# EAGLE design Codeshelf-0005.v02 (EAGLE 6.5.0)

## Sheet 1 of 2
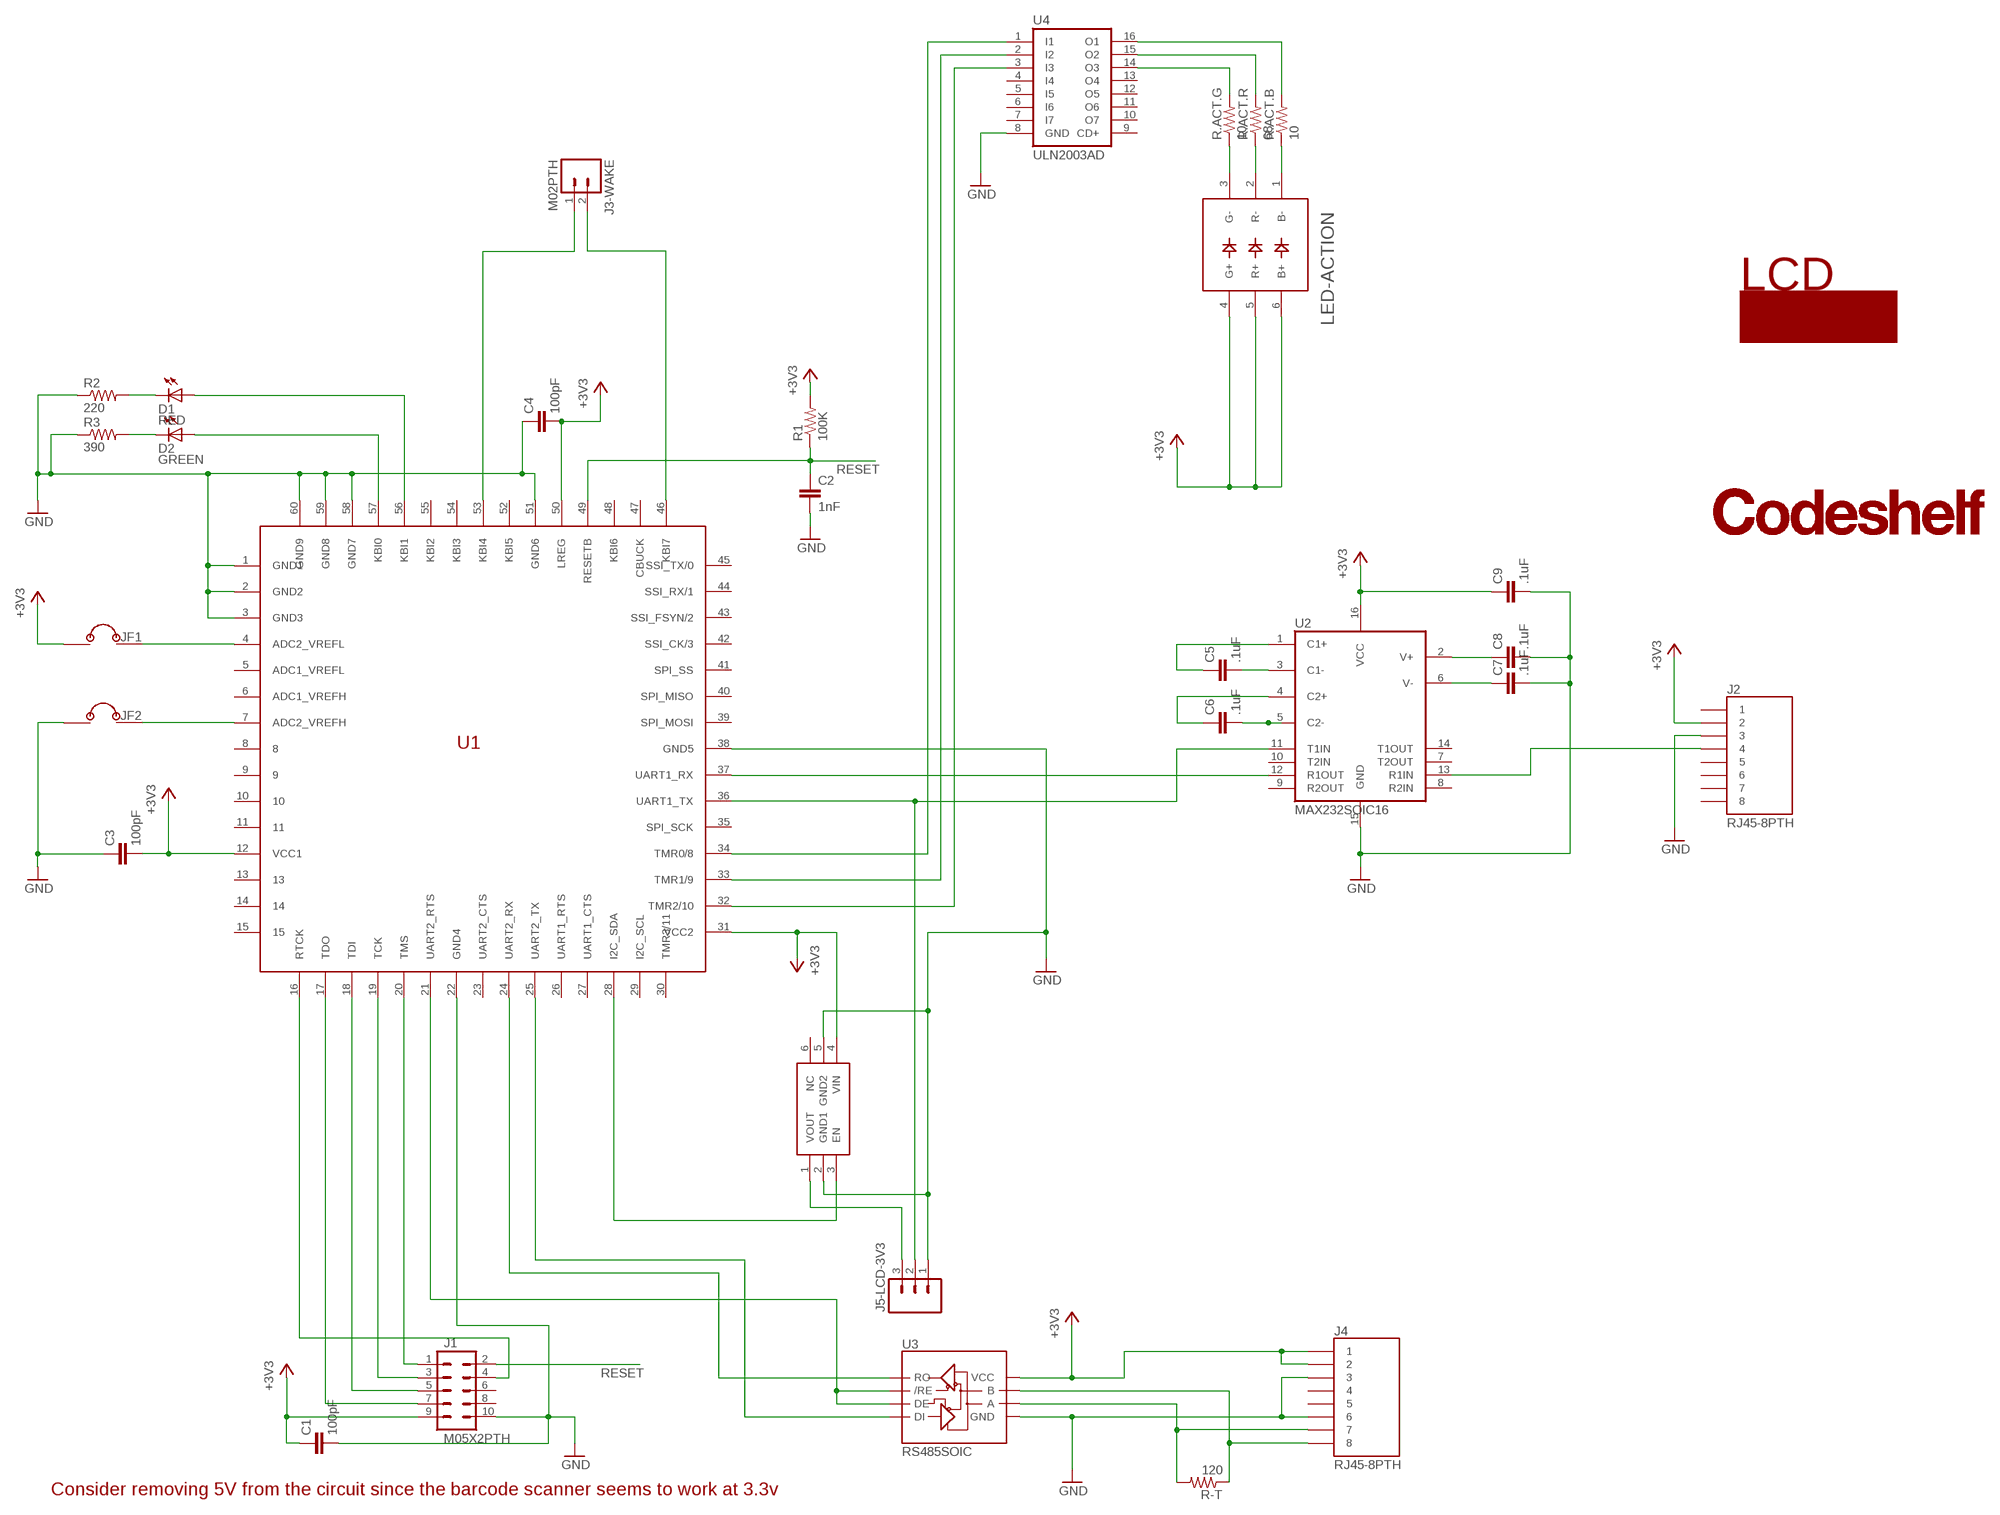
[diagram p0: schematic, sheet 1]

### Parts
C1  100pF  RF-C0603  [C0603]
C2  1nF  RF-C0603  [C0603]
C3  100pF  RF-C0603  [C0603]
C4  100pF  RF-C0603  [C0603]
C5  .1uF  RF-C0402  [C0402]
C6  .1uF  RF-C0402  [C0402]
C7  .1uF  RF-C0402  [C0402]
C8  .1uF  RF-C0402  [C0402]
C9  .1uF  RF-C0402  [C0402]
D1  RED  LEDCHIP-LED0805  [CHIP-LED0805]
D2  GREEN  LEDCHIP-LED0805  [CHIP-LED0805]
J1  M05X2PTH  [AVR_ICSP]
J2  RJ45-8PTH  [RJ45-8]
J3-WAKE  M02PTH  [1X02]
J4  RJ45-8PTH  [RJ45-8]
J5-LCD-3V3  M03PTH  [1X03]
JF1  JUMPER-2X-SMT-VIA  [JUMPER-VIA-2X]
JF2  JUMPER-2X-SMT-VIA  [JUMPER-VIA-2X]
LCD  LCD-SPARKFUN  LCD-SPARKFUN20X4  [LCD-20X4-SPARKFUN]
LED-ACTION  LED5060A  [PLCC-6]
LOGO  CODESHELF-LOGO  [CODESHELF-LOGO]
R1  100K  RF-R0402  [RF-R0402]
R2  220  RF-R0402  [RF-R0402]
R3  390  RF-R0402  [RF-R0402]
R-T  120  RF-R0402  [RF-R0402]
R.ACT.B  10  RF-R0402  [RF-R0402]
R.ACT.G  10  RF-R0402  [RF-R0402]
R.ACT.R  68  RF-R0402  [RF-R0402]
U1  ZSFM201-1A  [ZSFM201-1]
U2  MAX232SOIC16  [SO016]
U3  RS485SOIC  [SO08]
U4  ULN2003AD  [SO16]
U6  MIC94061C6  [SC70-6L]

### Nets
+3V3: C1.1 C3.2 C4.2 C9.1 J1.9 J2.2 J4.1 J4.2 JF1.1 LED-ACTION.4(G+) LED-ACTION.5(R+) LED-ACTION.6(B+) R1.2 U1.12(VCC1) U1.31(VCC2) U1.50(LREG) U2.16(VCC) U3.8(VCC) U6.4(VIN) ; also sheet 2
C1: C5.1 U2.1(C1+)
C2: C6.1 U2.4(C2+)
GND [GND]: C1.2 C2.2 C3.1 C4.1 C7.2 C8.2 C9.2 J1.10 J2.3 J4.3 J4.6 J5-LCD-3V3.1 JF2.1 R2.1 R3.1 U1.1(GND1) U1.2(GND2) U1.3(GND3) U1.22(GND4) U1.38(GND5) U1.51(GND6) U1.58(GND7) U1.59(GND8) U1.60(GND9) U2.15(GND) U3.5(GND) U4.8(GND) U6.2(GND1) U6.5(GND2) ; also sheet 2
N$1: D2.A U1.57(KBI0)
N$2: D1.A U1.56(KBI1)
N$3: D2.C R3.2
N$4: D1.C R2.2
N$6 [GND]: JF2.2 U1.7(ADC2_VREFH)
N$7 [+3V3]: JF1.2 U1.4(ADC2_VREFL)
N$8: C5.2 U2.3(C1-)
N$9: U1.28(I2C_SDA) U6.3(EN)
N$10 [+3V3]: J5-LCD-3V3.3 U6.1(VOUT)
N$11: C6.2 U2.5(C2-)
N$12: C7.1 U2.6(V-)
N$14: J3-WAKE.2 U1.46(KBI7)
N$15: C8.1 U2.2(V+)
N$16: J3-WAKE.1 U1.53(KBI4)
N$17: U1.25(UART2_TX) U3.4(DI)
N$18: U1.24(UART2_RX) U3.1(RO)
N$19: U1.21(UART2_RTS) U3.2(/RE) U3.3(DE)
N$20 [RS485]: J4.8 R-T.1 U3.7(B)
N$21 [RS485]: J4.7 R-T.2 U3.6(A)
N$28: R.ACT.R.2 U4.15(O2)
N$30: R.ACT.G.2 U4.14(O3)
N$33: LED-ACTION.1(B-) R.ACT.B.1
N$34: LED-ACTION.2(R-) R.ACT.R.1
N$35: LED-ACTION.3(G-) R.ACT.G.1
N$36: U1.34(TMR0/8) U4.1(I1)
N$37: U1.33(TMR1/9) U4.2(I2)
N$38: R.ACT.B.2 U4.16(O1)
N$39: U1.32(TMR2/10) U4.3(I3)
R1IN: J2.4 U2.13(R1IN)
R1OUT: U1.37(UART1_RX) U2.12(R1OUT)
RESET: C2.1 J1.2 R1.1 U1.49(RESETB)
RTCK: J1.4 U1.16(RTCK)
T1IN: J5-LCD-3V3.2 U1.36(UART1_TX) U2.11(T1IN)
TCK: J1.3 U1.19(TCK)
TDI: J1.5 U1.18(TDI)
TDO: J1.7 U1.17(TDO)
TMS: J1.1 U1.20(TMS)
Unconnected: J1.6 J1.8 J2.1 J2.5 J2.6 J2.7 J2.8 J4.4 J4.5 U1.5(ADC1_VREFL) U1.6(ADC1_VREFH) U1.8 U1.9 U1.10 U1.11 U1.13 U1.14 U1.15 U1.23(UART2_CTS) U1.26(UART1_RTS) U1.27(UART1_CTS) U1.29(I2C_SCL) U1.30(TMR3/11) U1.35(SPI_SCK) U1.39(SPI_MOSI) U1.40(SPI_MISO) U1.41(SPI_SS) U1.42(SSI_CK/3) U1.43(SSI_FSYN/2) U1.44(SSI_RX/1) U1.45(SSI_TX/0) U1.47(CBUCK) U1.48(KBI6) U1.52(KBI5) U1.54(KBI3) U1.55(KBI2) U2.7(T2OUT) U2.8(R2IN) U2.9(R2OUT) U2.10(T2IN) U2.14(T1OUT) U4.4(I4) U4.5(I5) U4.6(I6) U4.7(I7) U4.9(CD+) U4.10(O7) U4.11(O6) U4.12(O5) U4.13(O4) U6.6(NC)

### Notes on the sheet
- Consider removing 5V from the circuit since the barcode scanner seems to work at 3.3v

## Sheet 2 of 2
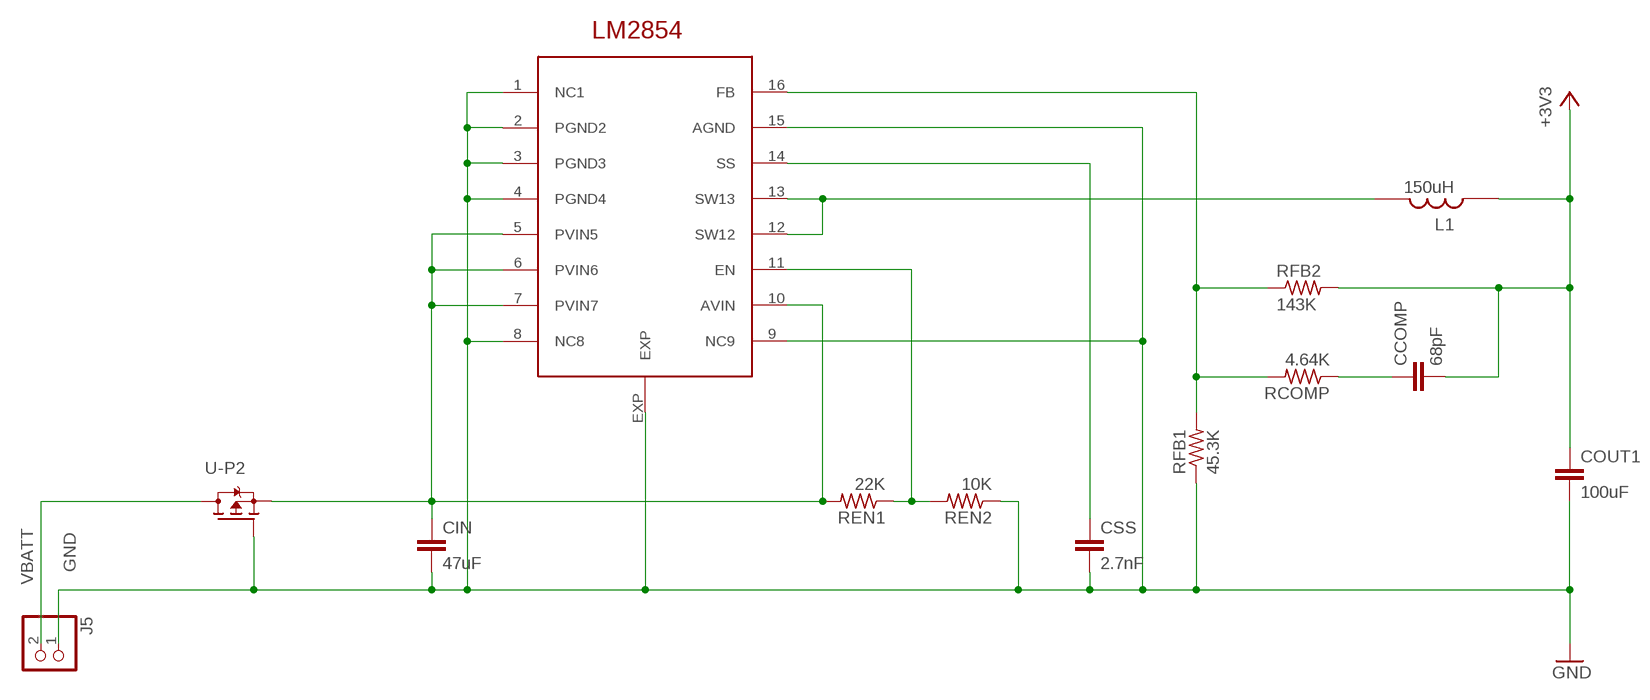
[diagram p1: schematic, sheet 2]

### Parts
CCOMP  68pF  RF-C0805  [C0805]
CIN  47uF  RF-C1210  [C1210K]
COUT1  100uF  RF-C1210  [C1210K]
CSS  2.7nF  RF-C0805  [C0805]
J5  PINHD-1X2/90  [1X02/90]
L1  150uH  INDUCTOR-SMD-UNUSUAL-SLF10165  [SLF10165]
RCOMP  4.64K  RF-R0402  [RF-R0402]
REN1  22K  RF-R0402  [RF-R0402]
REN2  10K  RF-R0402  [RF-R0402]
RFB1  45.3K  RF-R0402  [RF-R0402]
RFB2  143K  RF-R0402  [RF-R0402]
U-P1  LM2854MH  [HTSSOP16PWP]
U-P2  PCHANNEL-MOSFET-DPAK  [DPAK]

### Nets
+3V3: CCOMP.2 COUT1.1 L1.2 RFB2.2 ; also sheet 1
GND [GND]: CIN.2 COUT1.2 CSS.2 J5.1 REN2.1 RFB1.1 U-P1.1(NC1) U-P1.2(PGND2) U-P1.3(PGND3) U-P1.4(PGND4) U-P1.8(NC8) U-P1.9(NC9) U-P1.15(AGND) U-P1.EXP U-P2.1(G) ; also sheet 1
N$22: CSS.1 U-P1.14(SS)
N$23: L1.1 U-P1.12(SW12) U-P1.13(SW13)
N$24: RCOMP.2 RFB1.2 RFB2.1 U-P1.16(FB)
N$25: CCOMP.1 RCOMP.1
N$26: REN1.1 REN2.2 U-P1.11(EN)
V-PROT: CIN.1 REN1.2 U-P1.5(PVIN5) U-P1.6(PVIN6) U-P1.7(PVIN7) U-P1.10(AVIN) U-P2.3(S)
VBATT: J5.2 U-P2.4(D)

## Library data of the parts
C1 C3 C4 = GW-devices:RF-C: RF capacitor pads for FSL reference design; MFGN: Kemet; MFGP: C0603C101K5RACTU
C2 = GW-devices:RF-C: RF capacitor pads for FSL reference design; MFGN: Kemet; MFGP: C0603C102K4RACTU
C5-C9 = GW-devices:RF-C: RF capacitor pads for FSL reference design; MFGN: Murata; MFGP: GRM155R61C104KA88D; PRICE: 0.03
CCOMP = GW-devices:RF-C: RF capacitor pads for FSL reference design; MFGN: Yageo; MFGP: CC0805JRNPO9BN680; PRICE: 0.05
CIN = GW-devices:RF-C: RF capacitor pads for FSL reference design; MFGN: TDK; MFGP: C3225X5R1A476M250AC; PRICE: 1.03
COUT1 = GW-devices:RF-C: RF capacitor pads for FSL reference design; MFGN: TDK; MFGP: C3225X5R0J107M250AC; PRICE: 1.15
CSS = GW-devices:RF-C: RF capacitor pads for FSL reference design; MFGN: Yageo; MFGP: CC0805KRX7R9BB272; PRICE: 0.03
D1 = led:LED: LED OSRAM: - CHIPLED LG R971, LG N971, LY N971, LG Q971, LY Q971, LO R971, LY R971 LH N974, LH R974 LS Q976, LO Q976, LY Q976 LO Q996 - Hyper CHIPLED LW Q18S LB Q993, LB Q99A, LB R99A - SideLED LS A670, LO A670, LY A670, LG A670, LP A670 LB A673, LV A673, LT A673, LW A673 LH A674 LY A675 LS A676, LA A676, LO A676, LY A676, LW A676 LS A679, LY A679, LG A679 - Hyper Micro SIDELED® LS Y876, LA Y876, LO Y876, LY Y876 LT Y87S - SmartLED LW L88C, LW L88S LB L89C, LB L89S, LG L890 LS L89K, LO L89K, LY L89K LS L896, LA L896, LO L896, LY L896 - TOPLED LS T670, LO T670, LY T670, LG T670, LP T670 LSG T670, LSP T670, LSY T670, LOP T670, LYG T670 LG T671, LOG T671, LSG T671 LB T673, LV T673, LT T673, LW T673 LH T674 LS T676, LA T676, LO T676, LY T676, LB T676, LH T676, LSB T676, LW T676 LB T67C, LV T67C, LT T67C, LS T67K, LO T67K, LY T67K, LW E67C LS E67B, LA E67B, LO E67B, LY E67B, LB E67C, LV E67C, LT E67C LW T67C LS T679, LY T679, LG T679 LS T770, LO T770, LY T770, LG T770, LP T770 LB T773, LV T773, LT T773, LW T773 LH T774 LS E675, LA E675, LY E675, LS T675 LS T776, LA T776, LO T776, LY T776, LB T776 LHGB T686 LT T68C, LB T68C - Hyper Mini TOPLED® LB M676 - Mini TOPLED Santana® LG M470 LS M47K, LO M47K, LY M47K Source: http://www.osram.convergy.de LUXEON: - LUMILED® LXK2-PW12-R00, LXK2-PW12-S00, LXK2-PW14-U00, LXK2-PW14-V00 LXK2-PM12-R00, LXK2-PM12-S00, LXK2-PM14-U00 LXK2-PE12-Q00, LXK2-PE12-R00, LXK2-PE12-S00, LXK2-PE14-T00, LXK2-PE14-U00 LXK2-PB12-K00, LXK2-PB12-L00, LXK2-PB12-M00, LXK2-PB14-N00, LXK2-PB14-P00, LXK2-PB14-Q00 LXK2-PR12-L00, LXK2-PR12-M00, LXK2-PR14-Q00, LXK2-PR14-R00 LXK2-PD12-Q00, LXK2-PD12-R00, LXK2-PD12-S00 LXK2-PH12-R00, LXK2-PH12-S00 LXK2-PL12-P00, LXK2-PL12-Q00, LXK2-PL12-R00 Source: www.luxeon.com KINGBRIGHT: KA-3528ASYC Source: www.kingbright.com; MFGN: OSRAM; MFGP: Q62702P5182; NOTES: DNP
D2 = led:LED: LED OSRAM: - CHIPLED LG R971, LG N971, LY N971, LG Q971, LY Q971, LO R971, LY R971 LH N974, LH R974 LS Q976, LO Q976, LY Q976 LO Q996 - Hyper CHIPLED LW Q18S LB Q993, LB Q99A, LB R99A - SideLED LS A670, LO A670, LY A670, LG A670, LP A670 LB A673, LV A673, LT A673, LW A673 LH A674 LY A675 LS A676, LA A676, LO A676, LY A676, LW A676 LS A679, LY A679, LG A679 - Hyper Micro SIDELED® LS Y876, LA Y876, LO Y876, LY Y876 LT Y87S - SmartLED LW L88C, LW L88S LB L89C, LB L89S, LG L890 LS L89K, LO L89K, LY L89K LS L896, LA L896, LO L896, LY L896 - TOPLED LS T670, LO T670, LY T670, LG T670, LP T670 LSG T670, LSP T670, LSY T670, LOP T670, LYG T670 LG T671, LOG T671, LSG T671 LB T673, LV T673, LT T673, LW T673 LH T674 LS T676, LA T676, LO T676, LY T676, LB T676, LH T676, LSB T676, LW T676 LB T67C, LV T67C, LT T67C, LS T67K, LO T67K, LY T67K, LW E67C LS E67B, LA E67B, LO E67B, LY E67B, LB E67C, LV E67C, LT E67C LW T67C LS T679, LY T679, LG T679 LS T770, LO T770, LY T770, LG T770, LP T770 LB T773, LV T773, LT T773, LW T773 LH T774 LS E675, LA E675, LY E675, LS T675 LS T776, LA T776, LO T776, LY T776, LB T776 LHGB T686 LT T68C, LB T68C - Hyper Mini TOPLED® LB M676 - Mini TOPLED Santana® LG M470 LS M47K, LO M47K, LY M47K Source: http://www.osram.convergy.de LUXEON: - LUMILED® LXK2-PW12-R00, LXK2-PW12-S00, LXK2-PW14-U00, LXK2-PW14-V00 LXK2-PM12-R00, LXK2-PM12-S00, LXK2-PM14-U00 LXK2-PE12-Q00, LXK2-PE12-R00, LXK2-PE12-S00, LXK2-PE14-T00, LXK2-PE14-U00 LXK2-PB12-K00, LXK2-PB12-L00, LXK2-PB12-M00, LXK2-PB14-N00, LXK2-PB14-P00, LXK2-PB14-Q00 LXK2-PR12-L00, LXK2-PR12-M00, LXK2-PR14-Q00, LXK2-PR14-R00 LXK2-PD12-Q00, LXK2-PD12-R00, LXK2-PD12-S00 LXK2-PH12-R00, LXK2-PH12-S00 LXK2-PL12-P00, LXK2-PL12-Q00, LXK2-PL12-R00 Source: www.luxeon.com KINGBRIGHT: KA-3528ASYC Source: www.kingbright.com; MFGN: OSRAM; MFGP: Q65110P5179; NOTES: DNP
J1 = SparkFun:M05X2: Header 5x2 Standard 10-pin dual row 0.1" header. Commonly used with AVR-ISP. Use with Spark Fun Electronics SKU: PRT-00778
J2 J4 = SparkFun:RJ45-8: RJ45 Jack Simple RJ45, 8-pin connection - connector for common Cat5, Cat5e, and Cat6 Ethernet cables. Footprint not yet proven in production. Connector sku is PRT-00643; Breakout PCB sku is BOB-00716.; MFGN: FCI; MFGP: 54602-908LF; PRICE: 0.57
J3-WAKE = SparkFun-Connectors:M02: Standard 2-pin 0.1" header. Use with - straight break away headers ( PRT-00116) - right angle break away headers (PRT-00553) - swiss pins (PRT-00743) - machine pins (PRT-00117) - female headers (PRT-00115) Molex polarized connector foot print use with: PRT-08233 with associated crimp pins and housings. 2.54_SCREWTERM for use with PRT-10571. 3.5mm Screw Terminal footprints for PRT-08084 5mm Screw Terminal footprints for use with PRT-08433
J5 = pinhead:PINHD-1X2: PIN HEADER
J5-LCD-3V3 = SparkFun-Connectors:M03: Header 3 Standard 3-pin 0.1" header. Use with straight break away headers (SKU : PRT-00116), right angle break away headers (PRT-00553), swiss pins (PRT-00743), machine pins (PRT-00117), and female headers (PRT-00115). Molex polarized connector foot print use with SKU : PRT-08232 with associated crimp pins and housings.
JF1 JF2 = GW-devices:JUMPER-2X: This kind of jumper provides a place to place to put "green wires" for jumpering fetaure/options.
L1 = GW-devices:INDUCTOR-SMD-UNUSUAL; MFGN: TDK; MFGP: SLF10165T-1R5N6R83PF; PRICE: 1.23
LCD = GW-devices:LCD-SPARKFUN
LED-ACTION = GW-devices:LED5060: PLCC-6 5060 6000mcd RGB LED; MFGN: BiVar; MFGP: SMP6-RGB; PRICE: 0.25
LOGO = GW-devices:CODESHELF-LOGO; NOTES: DNP
R1 = GW-devices:RF-R: RF resistor pads for FSL reference design; MFGN: Panasonic; MFGP: ERJ-2GEJ104X
R2 = GW-devices:RF-R: RF resistor pads for FSL reference design; MFGN: Panasonic; MFGP: ERJ-2GEJ224X; NOTES: DNP
R3 = GW-devices:RF-R: RF resistor pads for FSL reference design; MFGN: Panasonic; MFGP: ERJ-2GEJ394X; NOTES: DNP
R-T = GW-devices:RF-R: RF resistor pads for FSL reference design; MFGN: Panasonic; MFGP: ERJ-2GEJ121X; PRICE: 0.02
R.ACT.B = GW-devices:RF-R: RF resistor pads for FSL reference design; MFGN: Panasonic; MFGP: ERJ-2GEJ100X; PRICE: 0.02
R.ACT.G = GW-devices:RF-R: RF resistor pads for FSL reference design; MFGP: ERJ-2GEJ100X; MFN: Panasonic; PRICE: 0.02
R.ACT.R = GW-devices:RF-R: RF resistor pads for FSL reference design; MFGN: Pansonic; MFGP: ERJ-2GEJ680X; PRICE: 0.02
RCOMP = GW-devices:RF-R: RF resistor pads for FSL reference design; MFGN: Vishay; MFGP: CRCW04024K64FKED; PRICE: 0.05
REN1 = GW-devices:RF-R: RF resistor pads for FSL reference design; MFGN: Panasonic; MFGP: ERJ-2GEJ223X; PRICE: 0.2
REN2 = GW-devices:RF-R: RF resistor pads for FSL reference design; MFGN: Panasonic; MFGP: ERJ-2GEJ103X; PRICE: 0.02
RFB1 = GW-devices:RF-R: RF resistor pads for FSL reference design; MFGN: Vishay; MFGP: CRCW040245K3FKED; PRICE: 0.04
RFB2 = GW-devices:RF-R: RF resistor pads for FSL reference design; MFGN: Vishay; MFGP: CRCW0402143KFKED; PRICE: 0.05
U1 = GW-devices:ZSFM201-1: The CEL MC13224V; MFGN: CEL; MFGP: ZFSM-201-1C; PRICE: 29.00
U2 = SparkFun:MAX232: RS232 Transceiver Very common IC. This is generically called 'MAX232', but works with the 3V equivalent MAX3232 generic ICs. Field tested and mother approved. Spark Fun Electronics SKU : COM-00316 (DIP) and COM-00589 (SMD); MFGN: TI; MFGP: MAX232DR; PRICE: 0.86
U3 = SparkFun:RS485; MFGN: TI; MFGP: SN65HVD1781DR; PRICE: 3.86
U4 = uln-udn:ULN2003A: DRIVER ARRAY; MFGN: TI; MFGP: ULN2003ADR; PRICE: 0.18
U6 = GW-devices:MIC94061; MFGN: Micrel; MFGP: MIC94061YC6 TR; PRICE: 1.50
U-P1 = GW-devices:LM2854; MFGN: TI; MFGP: LM2854MH-1000/NOPB; PRICE: 4.72
U-P2 = GW-devices:PCHANNEL-MOSFET; MFGN: On Semi; MFGP: NTD20P06LT4G

## Net classes
1 3v3: width 0.6 mm
2 5V: width 0.6 mm
3 +3V3: width 0.6 mm
4 GND: width 0.6 mm
5 RS485: width 0.4 mm

## Board
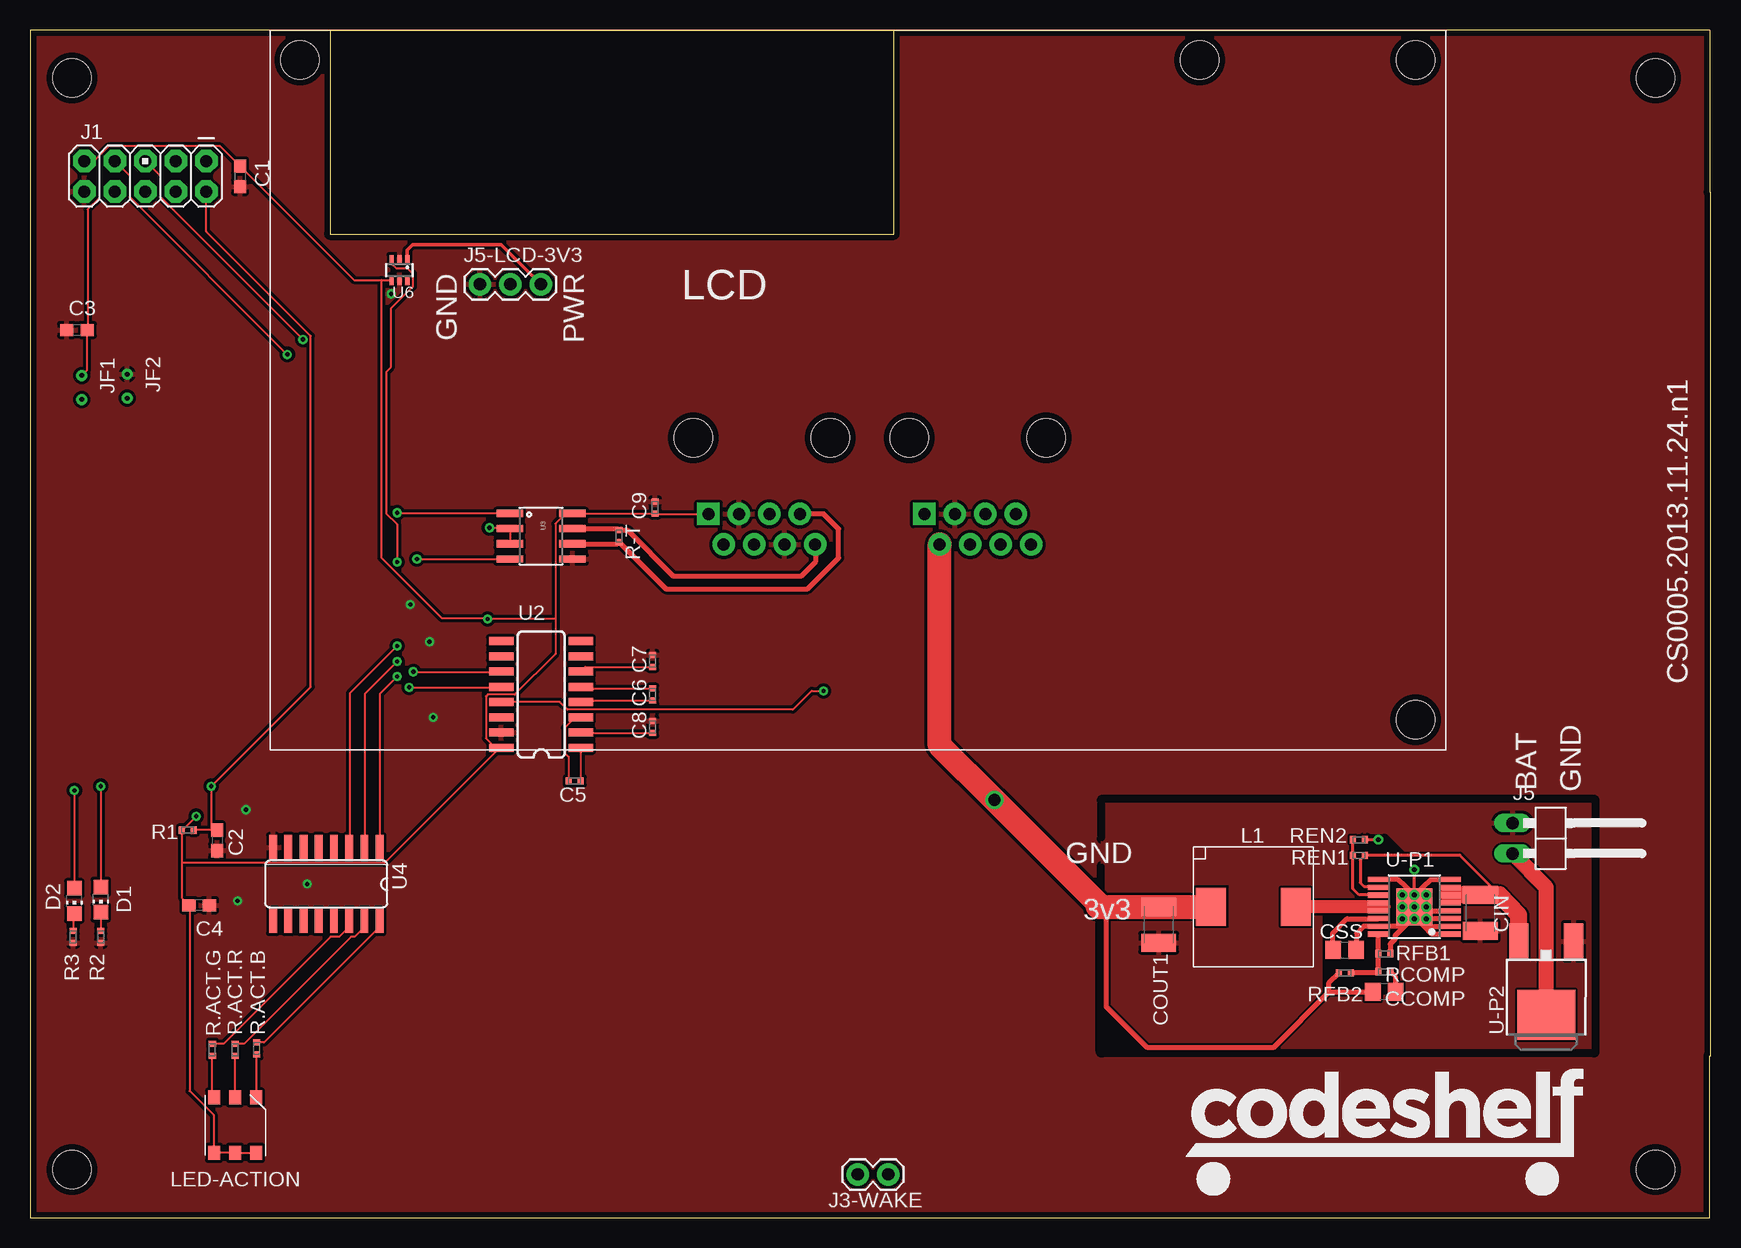
[diagram p2: board, top side]
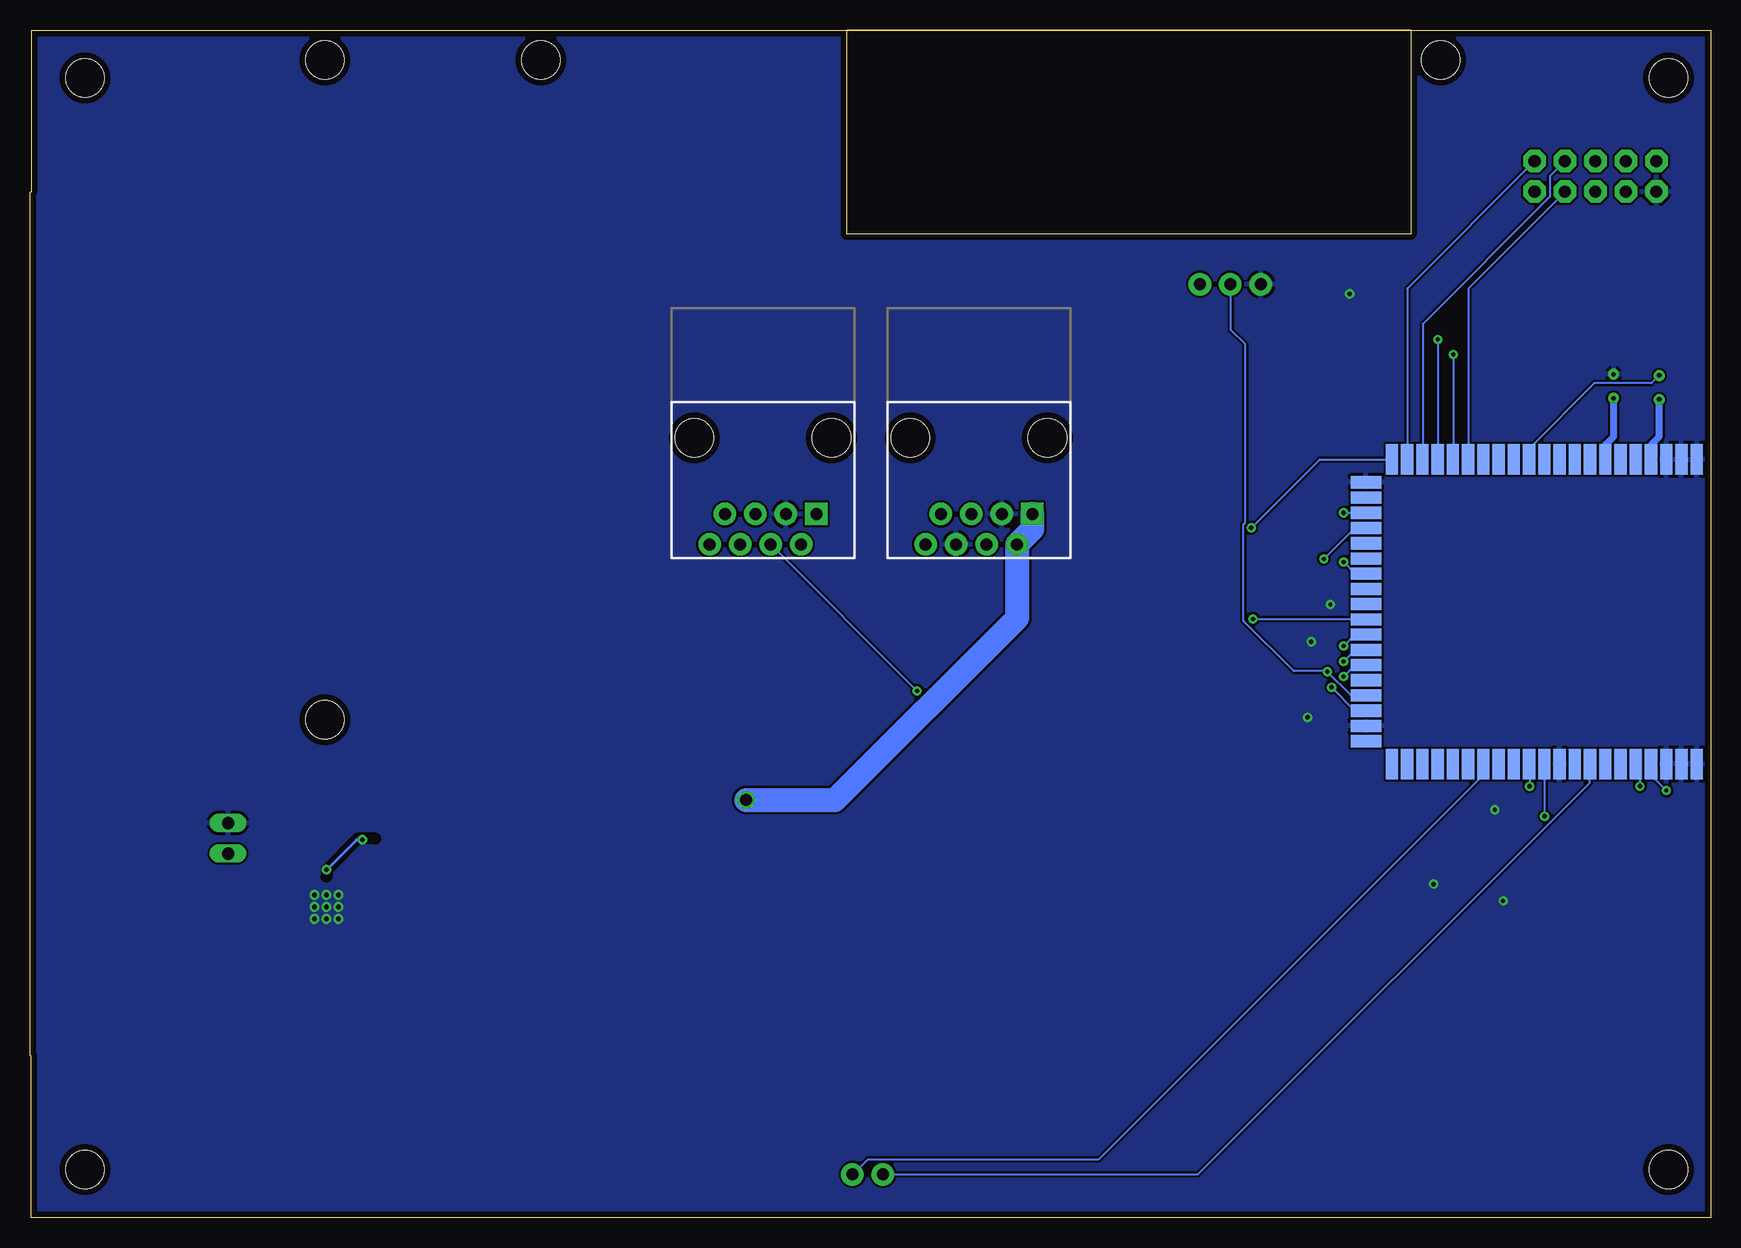
[diagram p3: board, bottom side, seen from below]

Size 140.1 x 99 mm. Coordinates in mm from the lower left corner, seen from the top.
Outline: 0,0 140,0 140,13.5 140.1,13.5 140.1,85.5 140,85.5 140,99 0,99 0,0
Copper layers (1*16): Top 0.0356mm / dielectric 1.5011mm / Bottom 0.0356mm
Design rules "SilverCircuits": minimum track width 7mil, minimum drill 14mil, track to track 7mil, track to pad 7mil, pad to pad 7mil, via to via 7mil, smd to smd 0mil, copper to edge 20mil, drill to drill 8mil, minimum pad ring 10mil, minimum via ring 8mil, stop-mask expansion 4mil, vias tented up to drill 0mil, thermal gap 10mil
Holes 3.2 mm at 3.5,95 135.5,95 135.5,4 3.5,4
tRestrict: area -10,33 to 0,67; area 117.6,23.4 to 119.5,25.9; area 117.4,27.9 to 119.5,28.6; area 111.5,27.9 to 113.4,28.6; area 111.3,24 to 113.4,24.6; area 112.8,23.1 to 119.5,23.8; area 112.9,23.3 to 117.5,28.5; area 107.8,18.6 to 114.1,25.4; area 97.1,24.2 to 99.9,27.7; 18 lines
bRestrict: area -10,33.1 to -0.6,67.3; 3 lines

### Footprints (pad centres in the part's own frame; a part is rotated, then mirrored left to right if it is on the bottom)
C0603 = smd 1.1 x 1: 1 -0.85,0; 2 0.85,0
C0402 = smd 0.5 x 0.6: 1 -0.5,0; 2 0.5,0
C0805 = smd 1.3 x 1.5: 1 -0.95,0; 2 0.95,0
C1210K = smd 1.5 x 2.9: 1 -1.5,0; 2 1.5,0
CHIP-LED0805 = smd 1.2 x 1.2: A 0,-1.05; C 0,1.05
AVR_ICSP = drill 1.016 pad 1.88 octagon: 1 -1.27,5.08; 2 1.27,5.08; 3 -1.27,2.54; 4 1.27,2.54; 5 -1.27,0; 6 1.27,0; 7 -1.27,-2.54; 8 1.27,-2.54; 9 -1.27,-5.08; 10 1.27,-5.08
RJ45-8 = drill 1 pad 1.88 square: 1 -4.445,6.35 | drill 1 pad 1.88: 2 -3.175,8.89; 3 -1.905,6.35; 4 -0.635,8.89; 5 0.635,6.35; 6 1.905,8.89; 7 3.175,6.35; 8 4.445,8.89 | hole 3.2: -5.715,0; 5.715,0
1X02 = drill 1.016 pad 1.88: 1 0,0; 2 2.54,0
1X02/90 = drill 1.016 long: 1 -1.27,-3.81; 2 1.27,-3.81
1X03 = drill 1.016 pad 1.88: 1 0,0; 2 2.54,0; 3 5.08,0
JUMPER-VIA-2X = drill 0.4: 1 -1,0; 2 1,0
SLF10165 = smd 2.5 x 3.2: 1 -3.55,0; 2 3.55,0
LCD-20X4-SPARKFUN = hole 3.2: -37.5,15.5; 37.5,15.5; 55.5,15.5; 55.5,-39.5
PLCC-6 = smd 1.18 x 1: 1 -2.31,1.75; 2 -2.31,0; 3 -2.31,-1.75; 4 2.31,-1.75; 5 2.31,0; 6 2.31,1.75
RF-R0402 = smd 0.5 x 0.6: 1 -0.5,0; 2 0.5,0
ZSFM201-1 = smd 2.54 x 1.016: 1 -12.7,28.829; 2 -12.7,27.559; 3 -12.7,26.289; 4 -12.7,25.019; 5 -12.7,23.749; 6 -12.7,22.479; 7 -12.7,21.209; 8 -12.7,19.939; 9 -12.7,18.669; 10 -12.7,17.399; 11 -12.7,16.129; 12 -12.7,14.859; 13 -12.7,13.589; 14 -12.7,12.319; 15 -12.7,11.049; 16 -12.7,9.779; 17 -12.7,8.509; 18 -12.7,7.239; 19 -12.7,5.969; 20 -12.7,4.699; 21 -12.7,3.429; 40 12.7,3.429; 41 12.7,4.699; 42 12.7,5.969; 43 12.7,7.239; 44 12.7,8.509; 45 12.7,9.779; 46 12.7,11.049; 47 12.7,12.319; 48 12.7,13.589; 49 12.7,14.859; 50 12.7,16.129; 51 12.7,17.399; 52 12.7,18.669; 53 12.7,19.939; 54 12.7,21.209; 55 12.7,22.479; 56 12.7,23.749; 57 12.7,25.019; 58 12.7,26.289; 59 12.7,27.559; 60 12.7,28.829 | smd 1.016 x 2.54: 22 -10.795,1.27; 23 -9.525,1.27; 24 -8.255,1.27; 25 -6.985,1.27; 26 -5.715,1.27; 27 -4.445,1.27; 28 -3.175,1.27; 29 -1.905,1.27; 30 -0.635,1.27; 31 0.635,1.27; 32 1.905,1.27; 33 3.175,1.27; 34 4.445,1.27; 35 5.715,1.27; 36 6.985,1.27; 37 8.255,1.27; 38 9.525,1.27; 39 10.795,1.27
SO016 = smd 0.66 x 2.032: 1 -4.445,-3.315; 2 -3.175,-3.315; 3 -1.905,-3.315; 4 -0.635,-3.315; 5 0.635,-3.315; 6 1.905,-3.315; 7 3.175,-3.315; 8 4.445,-3.315; 9 4.445,3.315; 10 3.175,3.315; 11 1.905,3.315; 12 0.635,3.315; 13 -0.635,3.315; 14 -1.905,3.315; 15 -3.175,3.315; 16 -4.445,3.315
SO08 = smd 0.61 x 2.21: 1 -1.905,-2.616; 2 -0.635,-2.616; 3 0.635,-2.616; 4 1.905,-2.616; 5 1.905,2.616; 6 0.635,2.616; 7 -0.635,2.616; 8 -1.905,2.616
SO16 = smd 0.66 x 2.032: 1 -4.445,-3.073; 2 -3.175,-3.073; 3 -1.905,-3.073; 4 -0.635,-3.073; 5 0.635,-3.073; 6 1.905,-3.073; 7 3.175,-3.073; 8 4.445,-3.073; 9 4.445,3.073; 10 3.175,3.073; 11 1.905,3.073; 12 0.635,3.073; 13 -0.635,3.073; 14 -1.905,3.073; 15 -3.175,3.073; 16 -4.445,3.073
SC70-6L = smd 0.35 x 0.8: 1 -0.65,-0.85; 2 0,-0.85; 3 0.65,-0.85; 4 0.65,0.85; 5 0,0.85; 6 -0.65,0.85
HTSSOP16PWP = smd 0.42 x 1.78: 1 -2.275,-2.975; 2 -1.625,-2.975; 3 -0.975,-2.975; 4 -0.325,-2.975; 5 0.325,-2.975; 6 0.975,-2.975; 7 1.625,-2.975; 8 2.275,-2.975; 9 2.275,2.975; 10 1.625,2.975; 11 0.975,2.975; 12 0.325,2.975; 13 -0.325,2.975; 14 -0.975,2.975; 15 -1.625,2.975; 16 -2.275,2.975 | smd 3.1 x 3: EXP 0,0
DPAK = smd 1.6 x 3: 1 -2.28,-4.04; 3 2.28,-4.04 | smd 4.826 x 4.191: 4 0,2.096

### Placement (x,y rotation side)
C1  17.5,86.8 270 top
C2  15.6,31.44 270 top
C3  3.92,74 0 top
C4  14.1,26.04 180 top
C5  45.4,36.4 180 top
C6  51.9,43.6 90 top
C7  51.9,46.4 90 top
C8  51.9,40.9 90 top
C9  52.1,59.2 90 top
CCOMP  112.89,18.8 180 top
CIN  120.89,25.4 270 top
COUT1  94.09,24.4 270 top
CSS  109.59,22.3 0 top
D1  5.9,26.5 180 top
D2  3.7,26.4 180 top
J1  9.61,86.8 270 top
J2  79,65 180 bottom
J3-WAKE  69,3.6 0 top
J4  61,65 180 bottom
J5  127.4,31.61 270 top
J5-LCD-3V3  37.5,77.8 0 top
JF1  4.3,69.2 270 top
JF2  8.1,69.3 270 top
L1  101.99,25.9 180 top
LCD  60,81 0 top
LED-ACTION  17.1,7.7 270 top
LOGO  96.34,1.84 0 top
R1  13.16,32.3 180 top
R2  5.9,23.4 90 top
R3  3.6,23.4 90 top
R-T  49.1,56.8 270 top
R.ACT.B  18.9,14.1 90 top
R.ACT.G  15.2,14 90 top
R.ACT.R  17.1,14 90 top
RCOMP  112.89,20.5 180 top
REN1  110.79,30.2 0 top
REN2  110.79,31.5 180 top
RFB1  112.89,22 180 top
RFB2  109.59,20.4 180 top
U1  30,50.5 270 bottom
U2  42.6,43.6 90 top
U3  42.6,56.8 270 top
U4  24.7,27.8 180 top
U6  30.8,79 180 top
U-P1  115.39,25.9 90 top
U-P2  126.39,19 180 top

### Tracks (layer width: path | path; a pad name or v marks a point on that pad's centre or on a via)
+3V3  (via drill 0.36, 1)
  Top 0.178: JF1.1 4.75,70.65 4.75,74 C3.2 4.8,74.05 4.8,84.05 5.75,85 5.75,88.4 5.7,88.45 | 29.3,78.15 27,78.15 C1.1 15.85,89.3 6.55,89.3 5.7,88.45 | 29.3,78.15 U6.4 | 5.7,88.45 5.35,88.1 4.55,88.1 J1.9 | LED-ACTION.6 17.15,5.4 LED-ACTION.5 LED-ACTION.4 15.3,5.45 15.3,8.55 13.3,10.55 13.3,26 C4.2 12.7,26.6 12.7,29.55 | 12.7,29.55 12.7,32.3 R1.2 12.75,32.35 v13.85,33.45 | C9.1 45.25,58.7 U3.8 45.15,58.65 44.6,58.65 43.8,57.85 43.8,49.9 | 43.8,49.9 43.8,47 40.4,43.6 38.15,43.6 38,43.45 38,39.95 38.75,39.2 39.25,39.2 U2.16 39.15,39.15 29.55,29.55 12.7,29.55 | 43.8,49.9 v38.15,49.9 38.1,49.95 34.35,49.95 29.3,55 29.3,78.15 | 52.15,58.65 C9.1 | J4.1 52.2,58.65 C9.1
  Top 0.4: 89.79,25.9 89.69,25.8 89.69,17.6 93.09,14.2 103.69,14.2 108.29,18.8 | 108.29,18.8 CCOMP.2 | RFB2.2 108.29,19.6 108.29,18.8
  Top 0.406: 88.99,25.9 89.29,25.3
  Top 0.6: L1.2 98.69,25.1 | 88.99,25.9 88.59,25.4
  Top 1.27: 89.69,25.8 89.69,25.9
  Top 1.676: L1.2 COUT1.1 89.79,25.9 89.3,25.9
  Top 2: 88.99,25.9 89.3,25.9 | 89.3,25.9 98.49,25.9 | 89.3,25.9 v80.4,34.8 75.83,39.38 J2.2
  Bottom 0.178: JF1.1 4.95,69.55 9.7,69.55 15.1,64.15 15.1,63.2 U1.12 | v13.85,33.45 13.85,37.8 U1.50 | v38.15,49.9 28.75,49.9 U1.31
  Bottom 2: v80.4,34.8 73,34.8 57.8,50 57.8,56.09 J4.2 56.56,57.38 J4.1
C1
  Top 0.178: C5.1 U2.1
C2
  Top 0.178: C6.1 46.05,43.1 45.95,43 U2.4
GND  (via drill 0.36, 0.4)
  Top 0.25: v112.39,31.5 REN2.1 | v115.39,29 v115.39,26.9 U-P1.EXP
  Top 0.254: 116.39,24.93 v116.39,24.9 | v116.39,26.9 v116.39,25.9 U-P1.EXP | U-P1.EXP v114.39,25.9 | v114.39,25.9 v115.39,26.9 | v114.39,25.9 v114.39,26.9 | v114.39,25.9 v114.39,24.9 | U-P1.EXP v115.39,24.9 | U-P1.EXP 115.39,25.43 115.89,24.93
  Top 0.4: 112.69,24.27 111.17,24.27 110.59,23.7 CSS.2 | v115.39,24.9 115.19,24.9 | RFB1.1 113.39,22.8 113.79,23.2 113.79,23.5 114.56,24.27
  Top 0.406: U-P1.1 116.86,23.62 116.22,24.27 | 116.22,24.27 U-P1.2 | 116.22,24.27 115.56,24.93 | 115.56,24.93 115.89,24.93 116.39,24.93 U-P1.3 | 115.56,24.93 115.39,25.1 114.56,24.27 112.69,24.27 U-P1.15 | U-P1.4 115.72,25.57 U-P1.EXP | U-P1.8 116.77,28.17 v115.39,26.9 114.02,28.17 U-P1.9
  Bottom 0.25: v112.39,31.5 112.89,31.5 v115.39,29
  other vias: 115.39,25.9 17.3,26.4 23.1,27.8 18,34 31.7,51.1 33.6,41.7 33.3,48 30.1,77
  pour Top (isolate 0.254, rank 2): 0,0 0,99 140,99 140,85.5 140.1,85.5 140.1,13.5 140,13.5 140,0
  pour Bottom: 0,0 0,99 140,99 140,85.5 140.1,85.5 140.1,13.5 140,13.5 140,0
  pour Bottom: 130.39,13.8 89.39,13.8 89.39,34.9 130.39,34.9
  pour Top: 130.39,13.8 89.39,13.8 89.39,34.9 130.39,34.9
N$1  (via drill 0.36)
  Top 0.178: v3.7,35.6 D2.A
  Bottom 0.178: v3.7,35.6 4.95,36.85 4.95,37.8 U1.57
N$2  (via drill 0.36)
  Top 0.178: v5.9,35.95 D1.A
  Bottom 0.178: v5.9,35.95 5.9,37.45 U1.56
N$3
  Top 0.178: R3.2 3.6,25.25 D2.C
N$4
  Top 0.178: D1.C R2.2
N$6
  Bottom 0.6: JF2.2 8.1,65.1 8.75,64.45 8.75,63.2 U1.7
N$7
  Bottom 0.6: JF1.2 4.3,65.1 4.95,64.45 4.95,63.2 U1.4
N$8
  Top 0.178: C5.2 44.9,38.4 44.6,38.7 44.6,40.85 45.4,41.65 45.9,41.65 U2.3
N$9  (via drill 0.36)
  Top 0.178: U6.3 30.15,79.5 30.5,79.15 31.45,79.15 31.9,78.7 31.9,77.6 30.1,75.8 30.1,70.9 29.7,70.5 29.7,58.7 30.6,57.8 v30.6,54.65
  Bottom 0.178: v30.6,54.65 29.65,53.7 28.75,53.7 U1.28
N$10
  Top 0.3: U6.1 31.45,80.65 31.9,81.1 39.28,81.1 J5-LCD-3V3.3
N$11
  Top 0.178: C6.2 46.05,44.1 45.95,44.2 U2.5
N$12
  Top 0.178: C7.1 46.3,45.9 45.95,45.55 U2.6
N$14
  Bottom 0.178: U1.46 19,37.8 19,36.85 51,4.85 70.25,4.85 71.5,3.6 J3-WAKE.2
N$15
  Top 0.178: C8.1 45.95,40.4 U2.2
N$16
  Bottom 0.178: J3-WAKE.1 42.75,3.6 10.1,36.25 10.1,37.8 U1.53
N$17  (via drill 0.36)
  Top 0.178: v32.25,54.9 39.95,54.9 U3.4
  Bottom 0.178: v32.25,54.9 29.7,57.45 28.75,57.45 U1.25
N$18  (via drill 0.36)
  Top 0.178: v30.6,58.75 39.95,58.75 U3.1
  Bottom 0.178: v30.6,58.75 28.75,58.75 U1.24
N$19  (via drill 0.36)
  Top 0.178: U3.3 40,56.2 40,57.4 U3.2 39.95,57.5 v38.3,57.5
  Bottom 0.178: U1.21 32.6,63.2 v38.3,57.5
N$20
  Top 0.406: U3.7 48.97,57.44 R-T.1 49.8,57.3 53.6,53.5 64.3,53.5 65.5,54.7 65.5,56.05 J4.8
N$21
  Top 0.406: U3.6 48.97,56.16 R-T.2 53,52.4 64.8,52.4 67.4,55 67.4,57.4 66.15,58.65 J4.7
N$22
  Top 0.4: CSS.1 108.59,23.7 109.79,24.9 112.39,24.9 U-P1.14
N$23
  Top 0.406: U-P1.12 U-P1.13 112.89,25.9
  Top 1.1: 112.89,25.9 L1.1
N$24
  Top 0.25: RCOMP.2 112.29,20.4
  Top 0.4: RCOMP.2 RFB1.2 | 112.29,20.4 RFB2.1
  Top 0.406: RFB1.2 112.39,23.6 U-P1.16
N$25
  Top 0.4: RCOMP.1 113.84,20.05 CCOMP.1
N$26
  Top 0.25: REN1.1 110.29,27.4 110.79,26.9 112.39,26.9
  Top 0.254: REN1.1 REN2.2 | U-P1.11 112.39,26.9
N$28
  Top 0.178: R.ACT.R.2 17.85,14.5 26.75,23.4 27.05,23.4 27.85,24.2 27.85,24.7 U4.15
N$30
  Top 0.178: R.ACT.G.2 16.15,14.5 25.05,23.4 25.75,23.4 26.6,24.25 26.6,24.7 U4.14
N$33
  Top 0.178: R.ACT.B.1 18.9,10.1 18.85,10.05 LED-ACTION.1
N$34
  Top 0.178: LED-ACTION.2 R.ACT.R.1
N$35
  Top 0.178: R.ACT.G.1 15.2,10.2 15.35,10.05 LED-ACTION.3
N$36  (via drill 0.36)
  Top 0.178: v30.6,45.1 29.15,43.65 29.15,30.9 U4.1
  Bottom 0.178: v30.6,45.1 29.65,46.05 28.75,46.05 U1.34
N$37  (via drill 0.36)
  Top 0.178: v30.6,46.35 27.9,43.65 27.9,30.9 U4.2
  Bottom 0.178: v30.6,46.35 29.65,47.3 28.75,47.3 U1.33
N$38
  Top 0.178: R.ACT.B.2 19.5,14.6 29.1,24.2 29.1,24.7 U4.16
N$39  (via drill 0.36)
  Top 0.178: v30.6,47.65 26.65,43.7 26.65,30.9 U4.3
  Bottom 0.178: v30.6,47.65 29.7,48.55 28.75,48.55 U1.32
R1IN  (via drill 0.36)
  Top 0.178: U2.13 39.3,43 44.15,43 44.8,42.35 63.6,42.35 65.15,43.9 v66.15,43.9
  Bottom 0.178: v66.15,43.9 J2.4
R1OUT  (via drill 0.36)
  Top 0.178: v31.6,44.2 39.25,44.2 U2.12
  Bottom 0.178: v31.6,44.2 29.65,42.25 28.75,42.25 U1.37
RESET  (via drill 0.36)
  Top 0.178: 15.1,32.3 C2.1 | 15.1,32.3 R1.1 | 15.1,32.3 v15.1,35.95 23.4,44.25 23.4,73.5 14.7,82.2 14.7,85.5 J1.2
  Bottom 0.178: v15.1,35.95 15.1,37.8 U1.49
RTCK
  Bottom 0.178: U1.16 20.2,63.2 20.2,77.45 12.15,85.5 J1.4
T1IN  (via drill 0.36)
  Top 0.178: v31.95,45.5 39.25,45.5 U2.11
  Bottom 0.178: U1.36 28.75,43.55 30,43.55 v31.95,45.5 32,45.55 34.75,45.55 38.95,49.75 38.95,57.8 38.8,57.95 38.8,72.8 40,74 40,77.8 J5-LCD-3V3.2
TCK
  Bottom 0.178: U1.19 24,63.2 24,74.5 13.4,85.1 13.4,86.8 12.15,88.05 J1.3
TDI  (via drill 0.36)
  Top 0.178: v22.75,73.2 10.85,85.1 10.85,86.85 9.65,88.05 J1.5
  Bottom 0.178: v22.75,73.2 U1.18
TDO  (via drill 0.36)
  Top 0.178: v21.45,71.95 8.3,85.1 8.3,86.85 7.1,88.05 J1.7
  Bottom 0.178: v21.45,71.95 21.45,63.2 U1.17
TMS
  Bottom 0.178: U1.20 25.3,77.45 14.7,88.05 J1.1
V-PROT
  Top 0.25: 112.34,27.6 111.19,27.6 110.89,27.9 110.89,29.8 REN1.2 119.19,30.2 122.49,26.9 | CIN.1 120.89,26.8 120.79,26.9
  Top 0.254: 112.34,27.6 U-P1.10
  Top 0.406: U-P1.6 U-P1.5 | 118.39,26.9 118.39,27.5 U-P1.7
  Top 1.422: 118.39,26.9 120.79,26.9 122.49,26.9 124.09,25.2 124.09,22.26 U-P2.3
  Top 1.676: 118.39,26.9 U-P1.6
VBATT
  Top 1.27: U-P2.4 126.39,27.53 J5.2

### Text on the board
tPlace: GND | PWR | CS0005.2013.11.24.n1 | BAT | GND | GND | 3v3